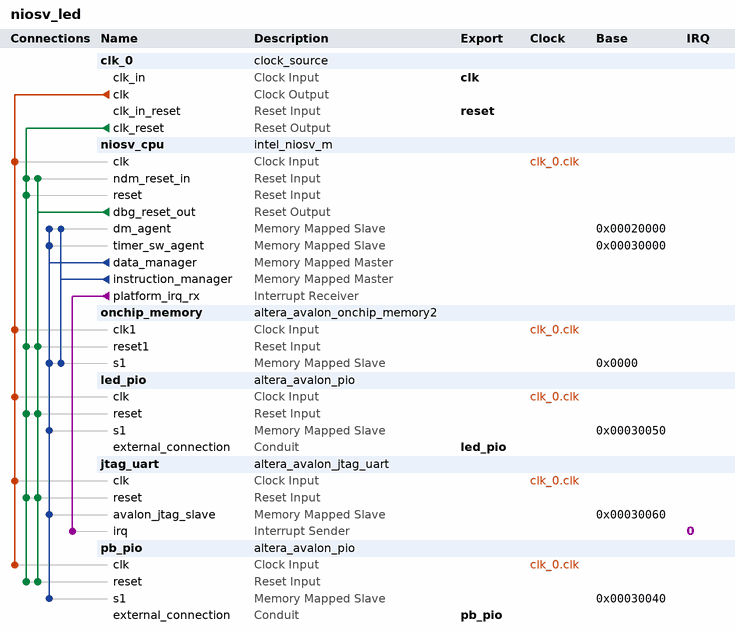
[diagram p0: system contents]
# Platform Designer (Qsys) system niosv_led, MAX 10 10M50DAF484C7G
# Parameters at their usual value, and those the tool derives, are not listed.
package require -exact qsys 25.1
create_system niosv_led
set_project_property DEVICE_FAMILY {MAX 10}
set_project_property DEVICE 10M50DAF484C7G

add_instance clk_0 clock_source 25.1
set_instance_parameter_value clk_0 clockFrequency 50000000

add_instance niosv_cpu intel_niosv_m 26.0.0
set_instance_parameter_value niosv_cpu enableAvalonInterface false
set_instance_parameter_value niosv_cpu enableDebugReset true
set_instance_parameter_value niosv_cpu enableECCFull false
set_instance_parameter_value niosv_cpu enableECCLite false
set_instance_parameter_value niosv_cpu hartId 0
set_instance_parameter_value niosv_cpu interruptMode 0
set_instance_parameter_value niosv_cpu pipelineArch true
set_instance_parameter_value niosv_cpu resetSlave onchip_memory.s1

add_instance onchip_memory altera_avalon_onchip_memory2 25.1
set_instance_parameter_value onchip_memory dataWidth 32
set_instance_parameter_value onchip_memory dualPort false
set_instance_parameter_value onchip_memory initMemContent true
set_instance_parameter_value onchip_memory initializationFileName onchip_mem.hex
set_instance_parameter_value onchip_memory memorySize 128000

add_instance led_pio altera_avalon_pio 25.1
set_instance_parameter_value led_pio direction Output
set_instance_parameter_value led_pio width 4

add_instance jtag_uart altera_avalon_jtag_uart 25.1
set_instance_parameter_value jtag_uart simInteractiveOptions NO_INTERACTIVE_WINDOWS

add_instance pb_pio altera_avalon_pio 25.1
set_instance_parameter_value pb_pio direction Input
set_instance_parameter_value pb_pio width 1

# connections
add_connection clk_0.clk jtag_uart.clk clock
add_connection clk_0.clk led_pio.clk clock
add_connection clk_0.clk niosv_cpu.clk clock
add_connection clk_0.clk onchip_memory.clk1 clock
add_connection clk_0.clk pb_pio.clk clock
add_connection clk_0.clk_reset jtag_uart.reset reset
add_connection clk_0.clk_reset led_pio.reset reset
add_connection clk_0.clk_reset niosv_cpu.ndm_reset_in reset
add_connection clk_0.clk_reset niosv_cpu.reset reset
add_connection clk_0.clk_reset onchip_memory.reset1 reset
add_connection clk_0.clk_reset pb_pio.reset reset
add_connection niosv_cpu.dbg_reset_out jtag_uart.reset reset
add_connection niosv_cpu.dbg_reset_out led_pio.reset reset
add_connection niosv_cpu.dbg_reset_out niosv_cpu.ndm_reset_in reset
add_connection niosv_cpu.dbg_reset_out onchip_memory.reset1 reset
add_connection niosv_cpu.dbg_reset_out pb_pio.reset reset
add_connection niosv_cpu.data_manager jtag_uart.avalon_jtag_slave avalon
set_connection_parameter_value niosv_cpu.data_manager/jtag_uart.avalon_jtag_slave baseAddress 0x00030060
add_connection niosv_cpu.data_manager led_pio.s1 avalon
set_connection_parameter_value niosv_cpu.data_manager/led_pio.s1 baseAddress 0x00030050
add_connection niosv_cpu.data_manager niosv_cpu.dm_agent avalon
set_connection_parameter_value niosv_cpu.data_manager/niosv_cpu.dm_agent baseAddress 0x00020000
add_connection niosv_cpu.data_manager niosv_cpu.timer_sw_agent avalon
set_connection_parameter_value niosv_cpu.data_manager/niosv_cpu.timer_sw_agent baseAddress 0x00030000
add_connection niosv_cpu.data_manager onchip_memory.s1 avalon
set_connection_parameter_value niosv_cpu.data_manager/onchip_memory.s1 baseAddress 0x0000
add_connection niosv_cpu.data_manager pb_pio.s1 avalon
set_connection_parameter_value niosv_cpu.data_manager/pb_pio.s1 baseAddress 0x00030040
add_connection niosv_cpu.instruction_manager niosv_cpu.dm_agent avalon
set_connection_parameter_value niosv_cpu.instruction_manager/niosv_cpu.dm_agent baseAddress 0x00020000
add_connection niosv_cpu.instruction_manager onchip_memory.s1 avalon
set_connection_parameter_value niosv_cpu.instruction_manager/onchip_memory.s1 baseAddress 0x0000
add_connection niosv_cpu.platform_irq_rx jtag_uart.irq interrupt
set_connection_parameter_value niosv_cpu.platform_irq_rx/jtag_uart.irq irqNumber 0

# exported interfaces
add_interface clk clock sink
set_interface_property clk EXPORT_OF clk_0.clk_in
add_interface led_pio conduit end
set_interface_property led_pio EXPORT_OF led_pio.external_connection
add_interface pb_pio conduit end
set_interface_property pb_pio EXPORT_OF pb_pio.external_connection
add_interface reset reset sink
set_interface_property reset EXPORT_OF clk_0.clk_in_reset

set_interconnect_requirement {$system} qsys_mm.clockCrossingAdapter HANDSHAKE
set_interconnect_requirement {$system} qsys_mm.enableEccProtection FALSE
set_interconnect_requirement {$system} qsys_mm.insertDefaultSlave FALSE
set_interconnect_requirement {$system} qsys_mm.maxAdditionalLatency 1

save_system niosv_led.qsys
